# Altium project LTO 16S BMS.PrjPcb (part 2 of 2)

## Sheet Pack_Interface.SchDoc: LTO 16S BMS
size A4; Engineer: Farris Matar; Organization: TESLA Motors, INC; Address1: 3500 Deer Creek Road; Address2: Palo Alto, CA; Address4: U.S.A.; SheetNumber: 8; SheetTotal: 8
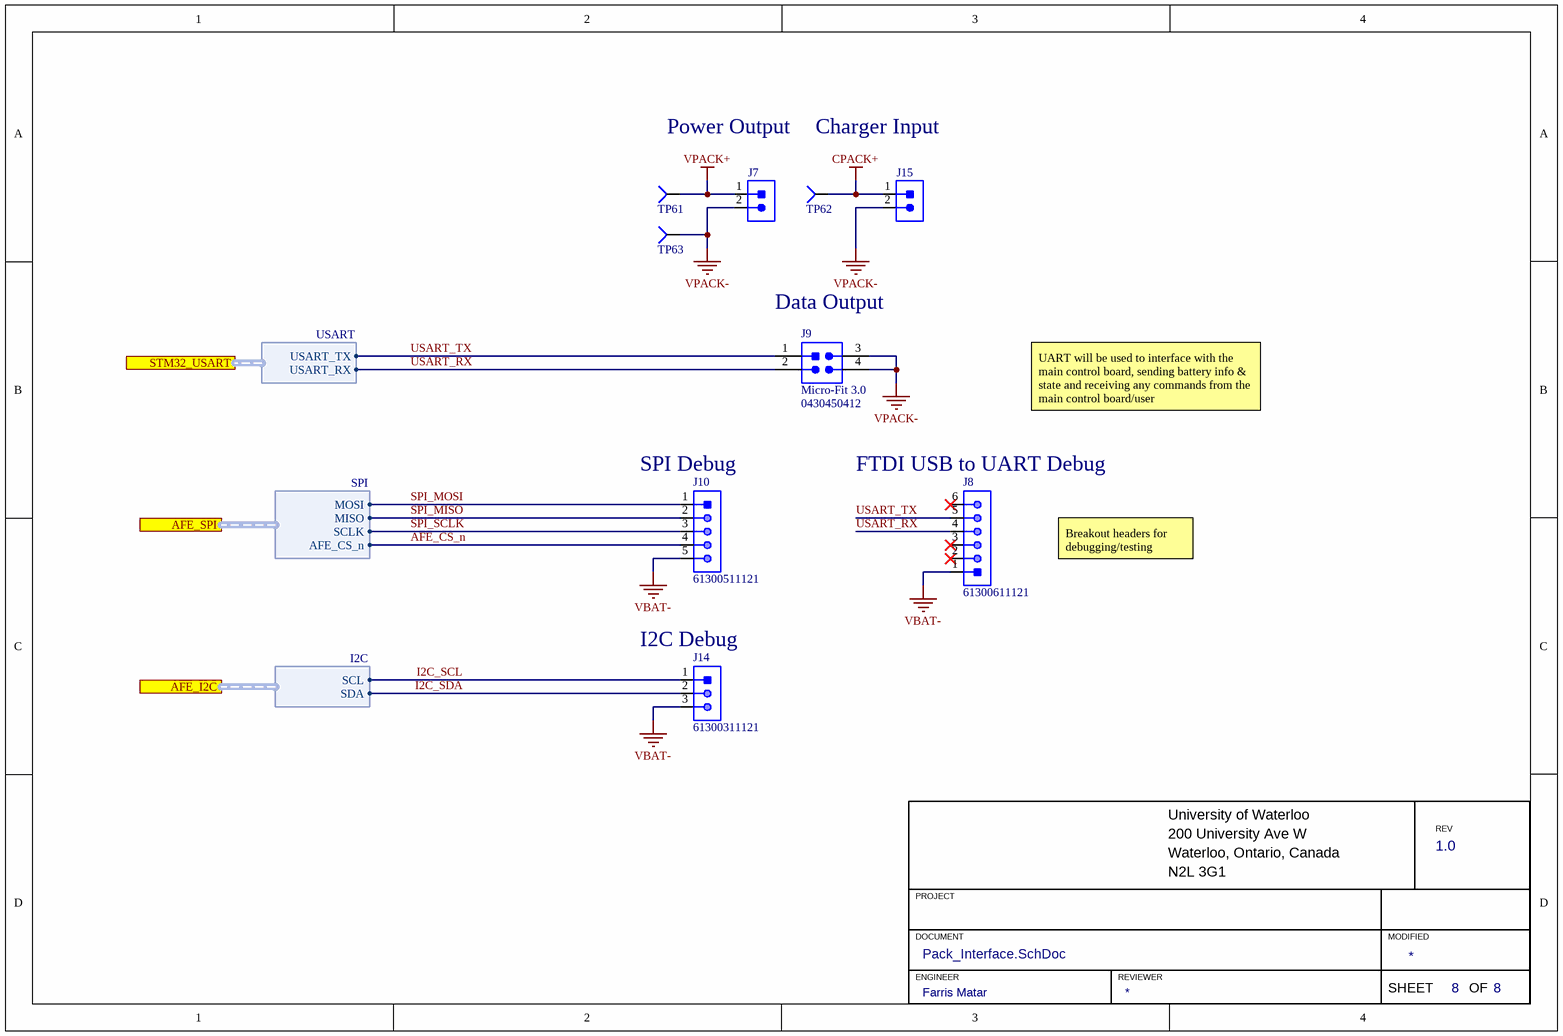
[diagram p7: Pack_Interface.SchDoc]

### Parts
J7  CON_2POS_XT90  [XT90]  (value not drawn)
J8  Manufacturer Part Number 1: 61300611121  [HDR1X6]  (hidden comment: HEADER 6x1)
J9  Family: Micro-Fit 3.0  [MOLEX-0430450412]  (hidden comment: 0430450412)
J10  Manufacturer Part Number 1: 61300511121  [HDR1X5]  (hidden comment: HEADER 5x1)
J14  Manufacturer Part Number 1: 61300311121  [HDR1X3]  (hidden comment: HEADER 3x1)
J15  CON_2POS_XT90  [XT90]  (value not drawn)
TP61  TESTPOINT_SMD_LOOP  [S1751-46R]  (value not drawn)
TP62  TESTPOINT_SMD_LOOP  [S1751-46R]  (value not drawn)
TP63  TESTPOINT_SMD_LOOP  [S1751-46R]  (value not drawn)

### Ports
AFE_I2C (harness I2C), AFE_SPI (harness SPI), STM32_USART (harness USART)

### Harnesses
USART: USART_TX, USART_RX
SPI: MOSI, MISO, SCLK, AFE_CS_n
I2C: SCL, SDA

### Nets
CPACK+: J15.1 TP62.1(=value)
VBAT-: J8.1 J10.5 J14.3
VPACK+: J7.1 TP61.1(=value)
VPACK-: J7.2 J9.3 J9.4 J15.2 TP63.1(=value)
AFE_CS_n: J10.4 ; port AFE_SPI.AFE_CS_n
I2C_SCL: J14.1 ; port AFE_I2C.SCL
I2C_SDA: J14.2 ; port AFE_I2C.SDA
SPI_MISO: J10.2 ; port AFE_SPI.MISO
SPI_MOSI: J10.1 ; port AFE_SPI.MOSI
SPI_SCLK: J10.3 ; port AFE_SPI.SCLK
USART_RX: J8.4 J9.2 ; port STM32_USART.USART_RX
USART_TX: J8.5 J9.1 ; port STM32_USART.USART_TX

Not connected (* = marked no-connect by the designer): J8 2* 3* 6*

### Notes on the sheet
- Power Output
- Charger Input
- (near J9) Data Output
- UART will be used to interface with the main control board, sending battery info & state and receiving any commands from the main control board/user
- (near J10) SPI Debug
- (near J8) FTDI USB to UART Debug
- Breakout headers for debugging/testing
- (near J14) I2C Debug
- University of Waterloo
- 200 University Ave W
- REV
- PROJECT
- Waterloo, Ontario, Canada
- N2L 3G1
- DOCUMENT
- ENGINEER
- REVIEWER
- MODIFIED
- SHEET
- OF

### Library data of the parts
J7 J15 = CON_2POS_XT90: HIGH QUALITY GOLD PLATED XT90 MA; Manufacturer 1: DFRobot; Manufacturer Part Number 1: FIT0588; Mounting Type: TH; Package/Footprint: XT90; Supplier 1: Digi-Key; Supplier Part Number 1: 1738-1438-ND
J8 = HEADER 6x1: CONN HEADER VERT 6POS 2.54MM; Manufacturer 1: Würth Elektronik; Supplier 1: Digi-Key; Mounting Type: TH; Pitch: 2.54mm; Supplier Part Number 1: 732-5319-ND
J9 = CON_MOLEX-HDR_2x2_TH: CONN HEADER VERT 4POS 3MM; Manufacturer 1: Molex; Voltage Rating: 600V; Current Rating: 8A; Pitch: 3mm; Supplier 1: Digi-Key; Supplier Part Number 1: WM1790-ND; Manufacturer Part Number 1: 0430450412
J10 = HEADER 5x1: CONN HEADER VERT 5POS 2.54MM; Manufacturer 1: Würth Elektronik; Supplier 1: Digi-Key; Mounting Type: TH; Pitch: 2.54mm; Supplier Part Number 1: 732-5318-ND
J14 = HEADER 3x1: CONN HEADER VERT 3POS 2.54MM; Manufacturer 1: Würth Elektronik; Supplier 1: Digi-Key; Mounting Type: TH; Pitch: 2.54mm; Supplier Part Number 1: 732-5316-ND
TP61-TP63 = TESTPOINT_SMD_LOOP: TESTPOINT SMD LOOP; Manufacturer 1: Harwin; Supplier 1: Digi-Key; Manufacturer Part Number 1: S1751-46R; Mounting Type: SMD; Package/Footprint: SMD; Supplier Part Number 1: 952-1478-1-ND

## Nets that join several sheets
3V3: BQ76952_AFE (C19.2 TP3.1 U1.35), Temperature_Sense (R81.2 R82.2 R83.2 R84.2), STM32_MCU (20 pins)
CPACK+: High_Side_FETs (9 pins), Pack_Interface (J15.1 TP62.1)
VBAT+: Battery_Interface (J13.2 TP2.1), BQ76952_AFE (C20.2 C21.2 D17.1 D18.1), High_Side_FETs (16 pins)
VBAT-: Battery_Interface (6 pins), BQ76952_AFE (10 pins), Balancing_FETs (C1.1 C2.1), Temperature_Sense (J3.2 J4.2 J5.2 J6.2), STM32_MCU (28 pins), Pack_Interface (J8.1 J10.5 J14.3)
VPACK+: High_Side_FETs (15 pins), Pack_Interface (J7.1 TP61.1)
VPACK-: BQ76952_AFE (C32.2 R62.1 R63.2), High_Side_FETs (D23.1), Pack_Interface (5 pins)
AFE_ALERT: BQ76952_AFE (R59.1 TP39.1 U1.25), STM32_MCU (U2.10)
AFE_CS_n: BQ76952_AFE (U1.29), STM32_MCU (R50.1 U2.14), Pack_Interface (J10.4)
CHG: BQ76952_AFE (U1.45), High_Side_FETs (R69.1 TP55.1)
DFETOFF: BQ76952_AFE (TP43.1 U1.30), STM32_MCU (U2.9)
DSG: BQ76952_AFE (U1.43), High_Side_FETs (D21.1 R70.1 TP54.1)
I2C_SCL: BQ76952_AFE (R90.2), STM32_MCU (R85.1 R93.1), Pack_Interface (J14.1)
I2C_SDA: BQ76952_AFE (R91.2), STM32_MCU (R86.1 R92.1), Pack_Interface (J14.2)
LD: BQ76952_AFE (TP44.1 U1.41), High_Side_FETs (R80.1)
PACK: BQ76952_AFE (TP60.1 U1.42), High_Side_FETs (R76.1)
PCHG: BQ76952_AFE (U1.40), High_Side_FETs (R68.1 TP53.1)
PDSG: BQ76952_AFE (U1.39), High_Side_FETs (R73.2 TP52.1)
SPI_MISO: BQ76952_AFE (R57.2), STM32_MCU (U2.12), Pack_Interface (J10.2)
SPI_MOSI: BQ76952_AFE (R87.2), STM32_MCU (R65.1), Pack_Interface (J10.1)
SPI_SCLK: BQ76952_AFE (R88.2), STM32_MCU (R64.1), Pack_Interface (J10.3)
T1: BQ76952_AFE (U1.21), Temperature_Sense (J3.1 R81.1 TP45.1)
T2: BQ76952_AFE (U1.22), Temperature_Sense (J4.1 R82.1 TP46.1)
T3: BQ76952_AFE (U1.23), Temperature_Sense (J5.1 R83.1 TP47.1)
T4: Temperature_Sense (J6.1 R84.1 TP48.1), STM32_MCU (U2.7)
USART_RX: STM32_MCU (U2.30), Pack_Interface (J8.4 J9.2)
USART_TX: STM32_MCU (U2.29), Pack_Interface (J8.5 J9.1)

## Assembly variants
BUILD: not fitted C28 R51 R66 R81 R82 R83 R90 R91 U3